# Altium schematic sheet 0096_CONNECTIVITY - FOX.SchDoc
size A3
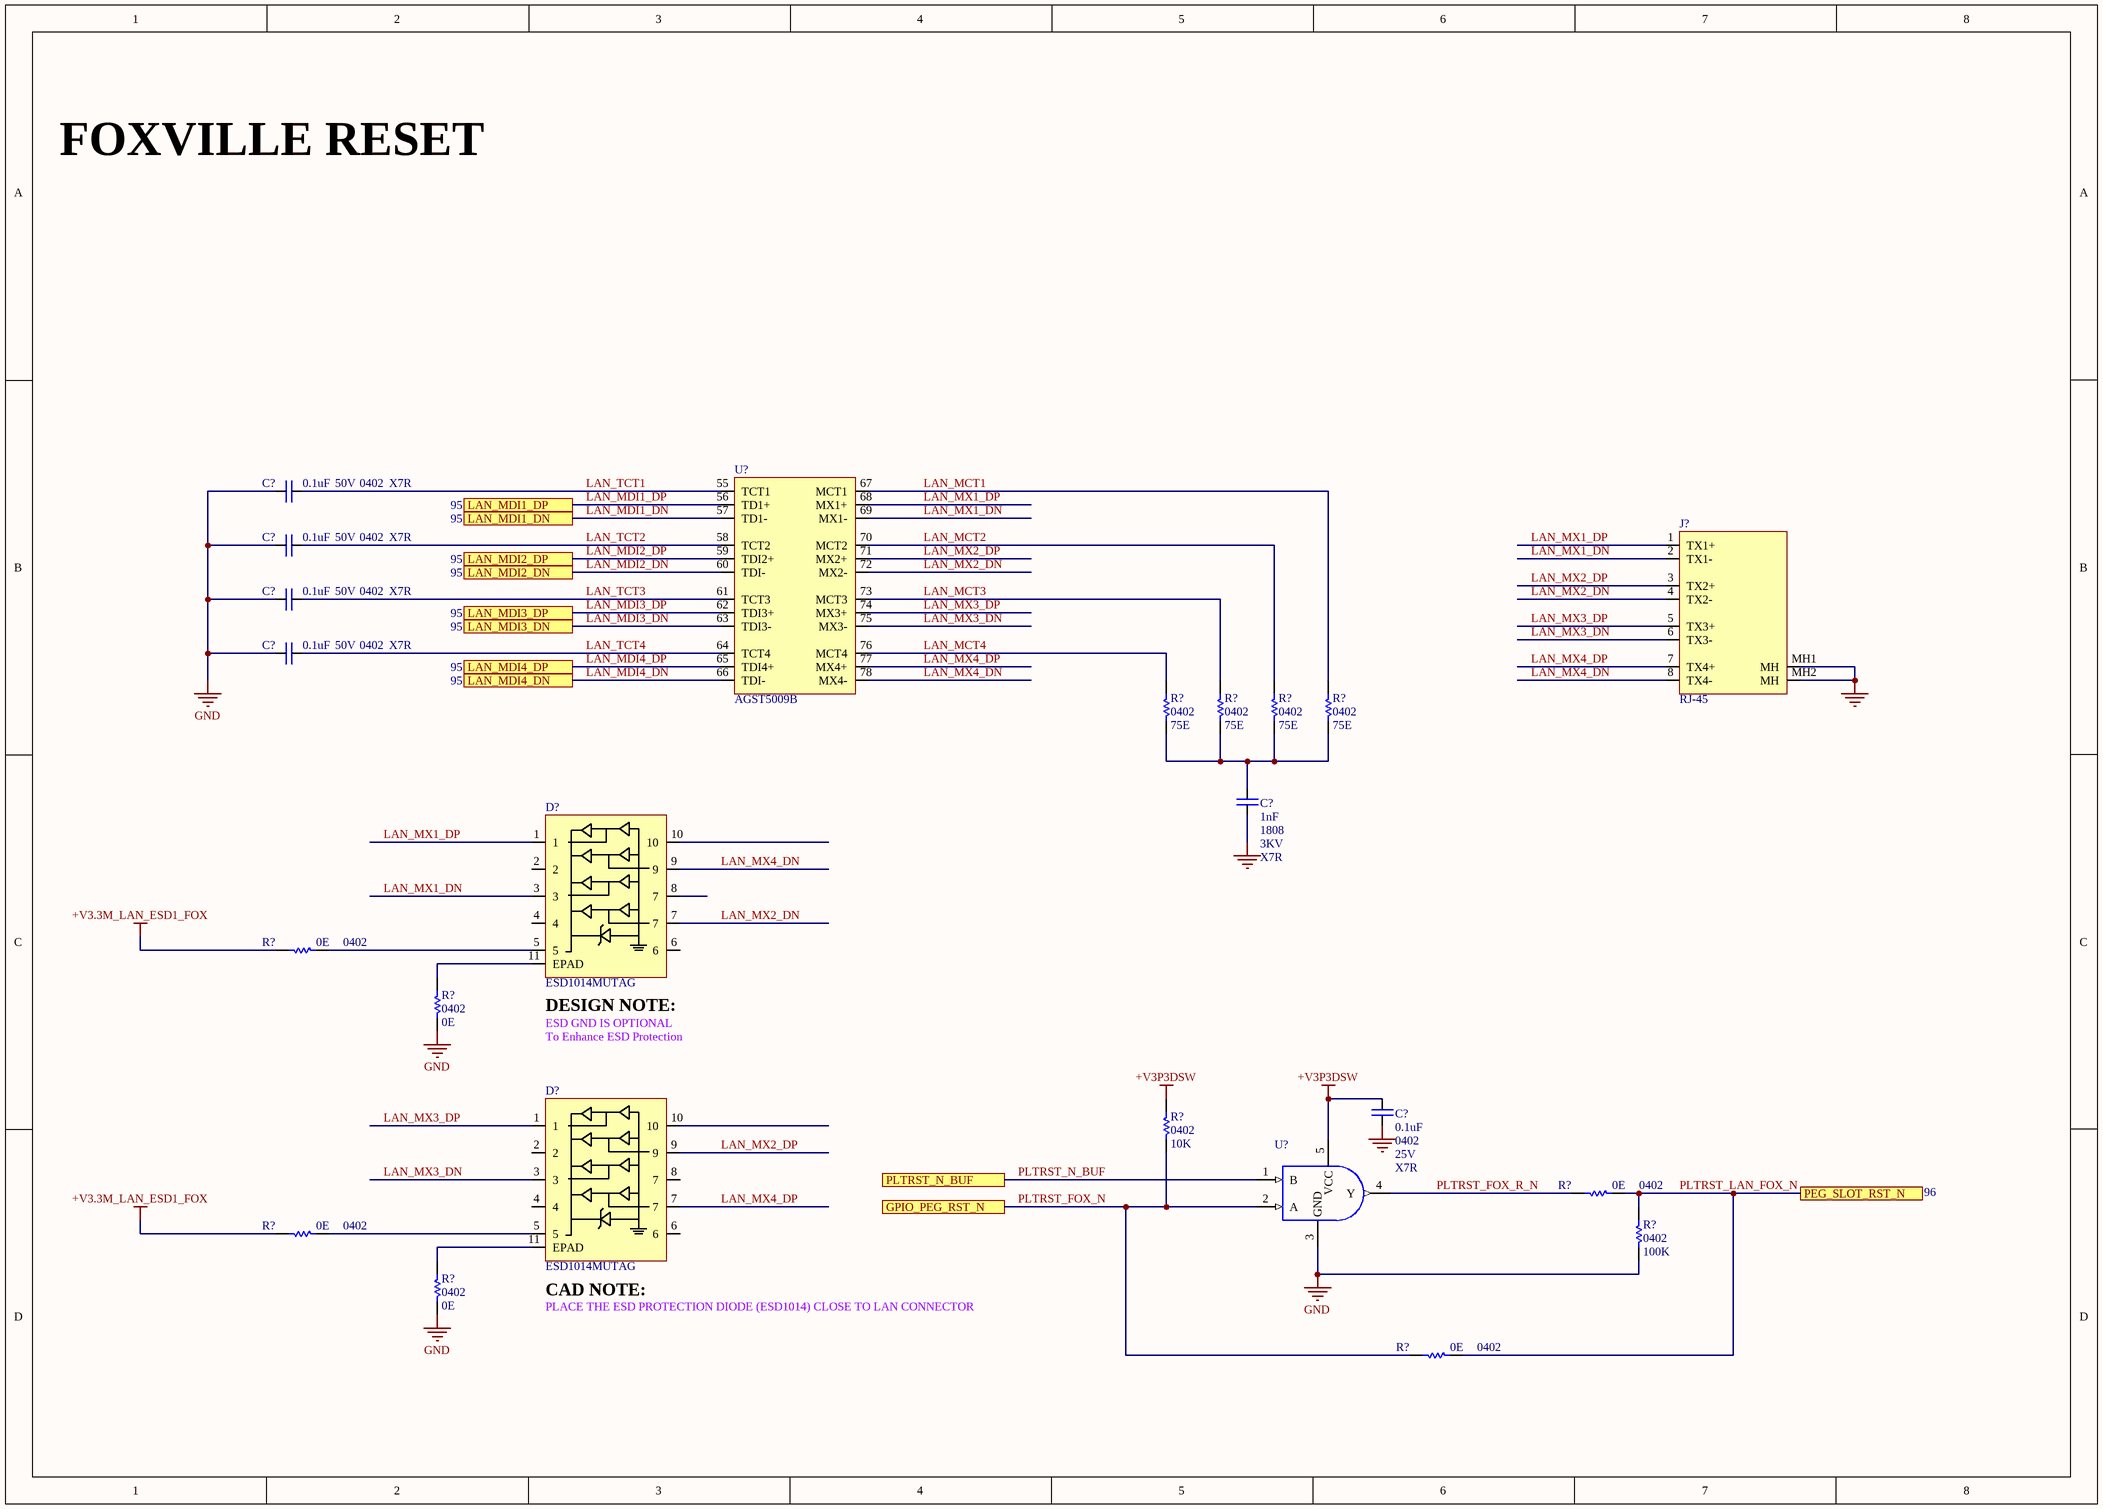
[diagram p0: 0096_CONNECTIVITY - FOX.SchDoc]

## Parts
(Parts that share a designator on the sheet are numbered #1, #2 ... from top to bottom, then left to right.)
C?#1  value 0.1uF  Case/Package: 0402  Voltage: 50V  Dielectric: X7R  [CAPC0402]
C?#2  value 0.1uF  Case/Package: 0402  Voltage: 50V  Dielectric: X7R  [CAPC0402]
C?#3  value 0.1uF  Case/Package: 0402  Voltage: 50V  Dielectric: X7R  [CAPC0402]
C?#4  value 0.1uF  Case/Package: 0402  Voltage: 50V  Dielectric: X7R  [CAPC0402]
C?#5  value 1nF  Case/Package: 1808  Voltage: 3KV  Dielectric: X7R
C?#6  value 0.1uF  Case/Package: 0402  Voltage: 25V  Dielectric: X7R  [CAPC0402]
D?#1  ESD1014MUTAG
D?#2  ESD1014MUTAG
J?  RJ-45
R?#1  value 75E  Case/Package: 0402  [RESC0402]  (hidden comment: Res)
R?#2  value 75E  Case/Package: 0402  [RESC0402]  (hidden comment: Res)
R?#3  value 75E  Case/Package: 0402  [RESC0402]  (hidden comment: Res)
R?#4  value 75E  Case/Package: 0402  [RESC0402]  (hidden comment: Res)
R?#5  value 0E  Case/Package: 0402  [RESC0402]  (hidden comment: Res)
R?#6  value 0E  Case/Package: 0402  [RESC0402]  (hidden comment: Res)
R?#7  value 10K  Case/Package: 0402  [RESC0402]  (hidden comment: Res)
R?#8  value 0E  Case/Package: 0402  [RESC0402]  (hidden comment: Res)
R?#9  value 0E  Case/Package: 0402  [RESC0402]  (hidden comment: Res)
R?#10  value 100K  Case/Package: 0402  [RESC0402]  (hidden comment: Res)
R?#11  value 0E  Case/Package: 0402  [RESC0402]  (hidden comment: Res)
R?#12  value 0E  Case/Package: 0402  [RESC0402]  (hidden comment: Res)
U?#1  AGST5009B
U?#2  74AHC1G08GW,125  [SOT353]  (value not drawn)

## Ports
GPIO_PEG_RST_N, LAN_MDI1_DN, LAN_MDI1_DP, LAN_MDI2_DN, LAN_MDI2_DP, LAN_MDI3_DN, LAN_MDI3_DP, LAN_MDI4_DN, LAN_MDI4_DP, PEG_SLOT_RST_N, PLTRST_N_BUF

## Nets
+V3.3M_LAN_ESD1_FOX: R?#5.1 R?#9.1
+V3P3DSW: C?#6.1 R?#7.2 U?#2.5(VCC)
GND: C?#1.1 C?#2.1 C?#3.1 C?#4.1 C?#5.1 C?#6.2 J?.MH1(MH) J?.MH2(MH) R?#6.1 R?#10.1 R?#11.1 U?#2.3(GND)
LAN_MCT1: R?#4.2 U?#1.67(MCT1)
LAN_MCT2: R?#3.2 U?#1.70(MCT2)
LAN_MCT3: R?#2.2 U?#1.73(MCT3)
LAN_MCT4: R?#1.2 U?#1.76(MCT4)
LAN_MDI1_DN: U?#1.57(TD1-) ; port LAN_MDI1_DN
LAN_MDI1_DP: U?#1.56(TD1+) ; port LAN_MDI1_DP
LAN_MDI2_DN: U?#1.60(TDI-) ; port LAN_MDI2_DN
LAN_MDI2_DP: U?#1.59(TDI2+) ; port LAN_MDI2_DP
LAN_MDI3_DN: U?#1.63(TDI3-) ; port LAN_MDI3_DN
LAN_MDI3_DP: U?#1.62(TDI3+) ; port LAN_MDI3_DP
LAN_MDI4_DN: U?#1.66(TDI-) ; port LAN_MDI4_DN
LAN_MDI4_DP: U?#1.65(TDI4+) ; port LAN_MDI4_DP
LAN_MX1_DN: D?#1.3 J?.2(TX1-) U?#1.69(MX1-)
LAN_MX1_DP: D?#1.1 J?.1(TX1+) U?#1.68(MX1+)
LAN_MX2_DN: D?#1.7 J?.4(TX2-) U?#1.72(MX2-)
LAN_MX2_DP: D?#2.9 J?.3(TX2+) U?#1.71(MX2+)
LAN_MX3_DN: D?#2.3 J?.6(TX3-) U?#1.75(MX3-)
LAN_MX3_DP: D?#2.1 J?.5(TX3+) U?#1.74(MX3+)
LAN_MX4_DN: D?#1.9 J?.8(TX4-) U?#1.78(MX4-)
LAN_MX4_DP: D?#2.7 J?.7(TX4+) U?#1.77(MX4+)
LAN_TCT1: C?#1.2 U?#1.55(TCT1)
LAN_TCT2: C?#2.2 U?#1.58(TCT2)
LAN_TCT3: C?#3.2 U?#1.61(TCT3)
LAN_TCT4: C?#4.2 U?#1.64(TCT4)
PLTRST_FOX_N: R?#7.1 R?#12.1 U?#2.2(A) ; port GPIO_PEG_RST_N
PLTRST_FOX_R_N: R?#8.1 U?#2.4(Y)
PLTRST_LAN_FOX_N: R?#8.2 R?#10.2 R?#12.2 ; port PEG_SLOT_RST_N
PLTRST_N_BUF: U?#2.1(B) ; port PLTRST_N_BUF
NetC?#5_2: C?#5.2 R?#1.1 R?#2.1 R?#3.1 R?#4.1
NetD?#1_5: D?#1.5 R?#5.2
NetD?#1_11: D?#1.11(EPAD) R?#6.2
NetD?#2_5: D?#2.5 R?#9.2
NetD?#2_11: D?#2.11(EPAD) R?#11.2

Not connected (* = marked no-connect by the designer): D?#1 2 4 6 8(7) 10; D?#2 2 4 6 8(7) 10

## Notes on the sheet
- FOXVILLE RESET
- (near D?#1) DESIGN NOTE:
- ESD GND IS OPTIONAL
- To Enhance ESD Protection
- (near D?#2) CAD NOTE:
- PLACE THE ESD PROTECTION DIODE (ESD1014) CLOSE TO LAN CONNECTOR

## Library data of the parts
C?#1-C?#4 = Cap: CAP CER 0.1uF 50V X7R 0402
C?#5 = Cap: CAP CER 1nF 3KV X7R 1808
C?#6 = Cap: CAP CER 0.1uF 25V X7R 0402
D?#1 D?#2 = ESD1014MUTAG: ESD Suppressors / TVS Diodes LOW CAP TVS ARRAY
R?#1-R?#4 = Res: Thick Film Resistor - 75ohm, 1%, 0402
R?#5 R?#6 R?#8 R?#9 R?#11 R?#12 = Res: Thick Film Resistor -  0ohm, 1%, 0402
  R?#12: DNP: DNP
R?#7 = Res: Thick Film Resistor - 10Kohm, 1%, 0402
R?#10 = Res: Thick Film Resistor - 100Kohm, 1%, 0402
U?#2 = 74AHC1G08GW,125: Logic IC - Gate NXP Semiconductors 74AHC1G08GW, 125 AND gate 74AHC TSSOP 5; Manufacturer: Nexperia; Supplier 1: Digi-Key; Manufacturer Part Number: 74AHC1G08GW,125; Stock 1: 41783; Pricing 1: 1=0.27, 10=0.223, 25=0.1872, 100=0.1184, 250=0.0914, 500=0.0779, 1000=0.053 (USD); Case/Package: SOT-353; Supplier Part Number 1: 1727-3148-1-ND